# EAGLE design AD590 (EAGLE 9.6.2)
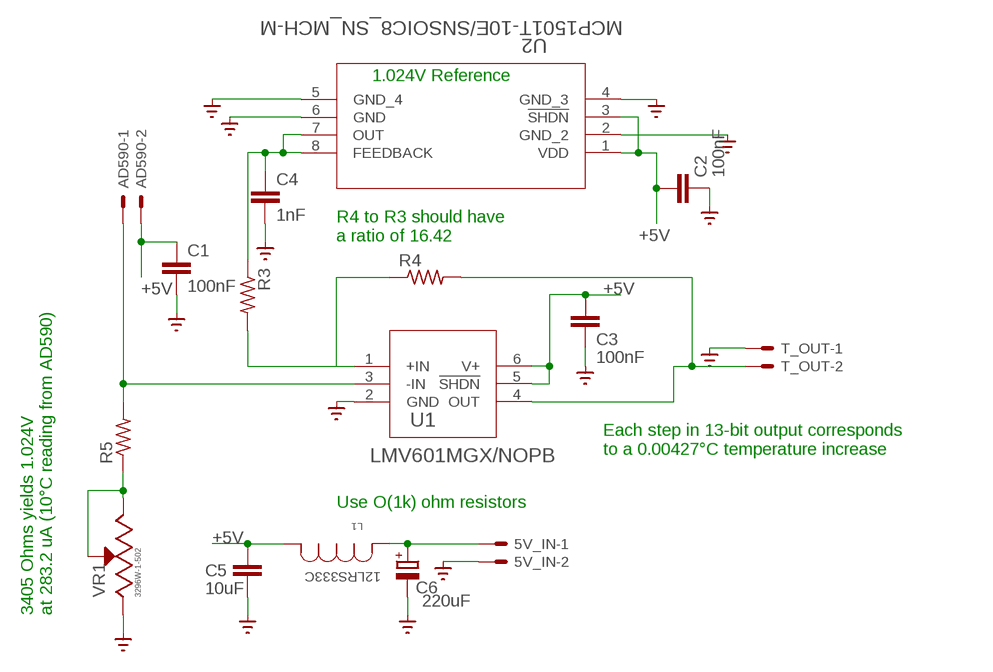
[diagram p0: schematic, sheet 1]

## Parts
5V_IN  JST-XH-02-PIN-LONG-PAD  [JST-XH-02-PACKAGE-LONG-PAD]
AD590  JST-XH-02-PIN-LONG-PAD  [JST-XH-02-PACKAGE-LONG-PAD]
C1  100nF  C-EUC0603  [C0603]
C2  100nF  C-EUC0603  [C0603]
C3  100nF  C-EUC0603  [C0603]
C4  1nF  C-EUC0603  [C0603]
C5  10uF  C-EUC0603  [C0603]
C6  220uF  CPOL-EUE3.5-8  [E3,5-8]
L1  12LRS333C  [IND_MURATA_1200LRS_MUR]
R3  R-US_R1206  [R1206]
R4  R-US_R1206  [R1206]
R5  R-US_R1206  [R1206]
T_OUT  JST-XH-02-PIN-LONG-PAD  [JST-XH-02-PACKAGE-LONG-PAD]
U1  LMV601MGX/NOPB  [DCK6_TEX]
U2  MCP1501T-10E/SNSOIC8_SN_MCH-M  [SOIC8_SN_MCH-M]
VR1  3296W-1-502  [TRIM_3296W-1-502]

## Nets
+5V: AD590.2 C1.1 C2.1 C3.1 C5.1 L1.1 U1.5(!SHDN) U1.6(V+) U2.1(VDD) U2.3(!SHDN)
GND: 5V_IN.2 C1.2 C2.2 C3.2 C4.2 C5.2 C6.- T_OUT.1 U1.2(GND) U2.2(GND_2) U2.4(GND_3) U2.5(GND_4) U2.6(GND) VR1.1(CCW) ; supply symbol labelled SUPPLY0_GND_
N$1: R5.1 VR1.2(WIPER) VR1.3(CW)
N$2: AD590.1 R5.2 U1.3(-IN)
N$4: C4.1 R3.1 U2.7(OUT) U2.8(FEEDBACK)
N$5: 5V_IN.1 C6.+ L1.3
N$6: R4.2 T_OUT.2 U1.4(OUT)
N$9: R3.2 R4.1 U1.1(+IN)

## Notes on the sheet
- 1.024V Reference
- R4 to R3 should have
  a ratio of 16.42
- Each step in 13-bit output corresponds
  to a 0.00427°C temperature increase
- Use O(1k) ohm resistors
- 3405 Ohms yields 1.024V 
  at 283.2 uA (10°C reading from AD590)

## Library data of the parts
5V_IN AD590 T_OUT = Rembrandt Electronics - JST XH Connectors v1-0:JST-XH-02-PIN: JST XH Connector 2 Pin Wire to board connector. Pitch: 2,54 mm, (0.100") Number of pins: 2 Created by Rembrandt Electronics www.rembrandtelectronics.com
C1-C5 = rcl:C-EU: CAPACITOR, European symbol; SPICEPREFIX: C
C6 = rcl:CPOL-EU: POLARIZED CAPACITOR, European symbol; SPICEPREFIX: C
L1 = 12LRS333C:12LRS333C: MURATA 33uH 2.1A INDUCTOR; BUILT_BY: EMA_UL_Team; MANUFACTURER_PART_NUMBER: 12LRS333C; SOURCELIBRARY: Murata_2010-01-01IND_1200LRS; VENDOR: Murata
R3-R5 = rcl:R-US_: RESISTOR, American symbol; SPICEPREFIX: R
U1 = LMV601MGX:NOPB:LMV601MGX/NOPB; COPYRIGHT: Copyright (C) 2022 Ultra Librarian. All rights reserved.; DIGI-KEY_PART_NUMBER_1: 296-46438-1-ND; DIGI-KEY_PART_NUMBER_2: 296-46438-2-ND; DIGI-KEY_PART_NUMBER_3: 296-46438-6-ND; DIGI-KEY_PART_NUMBER_4: LMV601MGX/NOPB-ND; MANUFACTURER_PART_NUMBER: LMV601MGX/NOPB; MFR_NAME: Texas Instruments
U2 = MCP1501T-10E:Sn:MCP1501T-10E/SN; COPYRIGHT: Copyright (C) 2022 Ultra Librarian. All rights reserved.; MANUFACTURER_PART_NUMBER: MCP1501T-10E/SN; MFR_NAME: Microchip
VR1 = 3296W-1-502:3296W-1-502: Res Cermet Trimmer 500K Ohm 10% 0.5W 25(Elec)Turn 2.19mm (9.53 X 4.83 X 11.55mm) Pin Thru-Hole Tube; DESCRIPTION: 5 kOhms 0.5W, 1/2W PC Pins Through Hole Trimmer Potentiometer Cermet 25 Turn Top Adjustment; DIGI-KEY_PART_NUMBER: 3296W-1-502RLFTR-ND; MF: Bourns; MP: 3296W-1-502; PACKAGE: SOT-23-5 Bourns

## Board
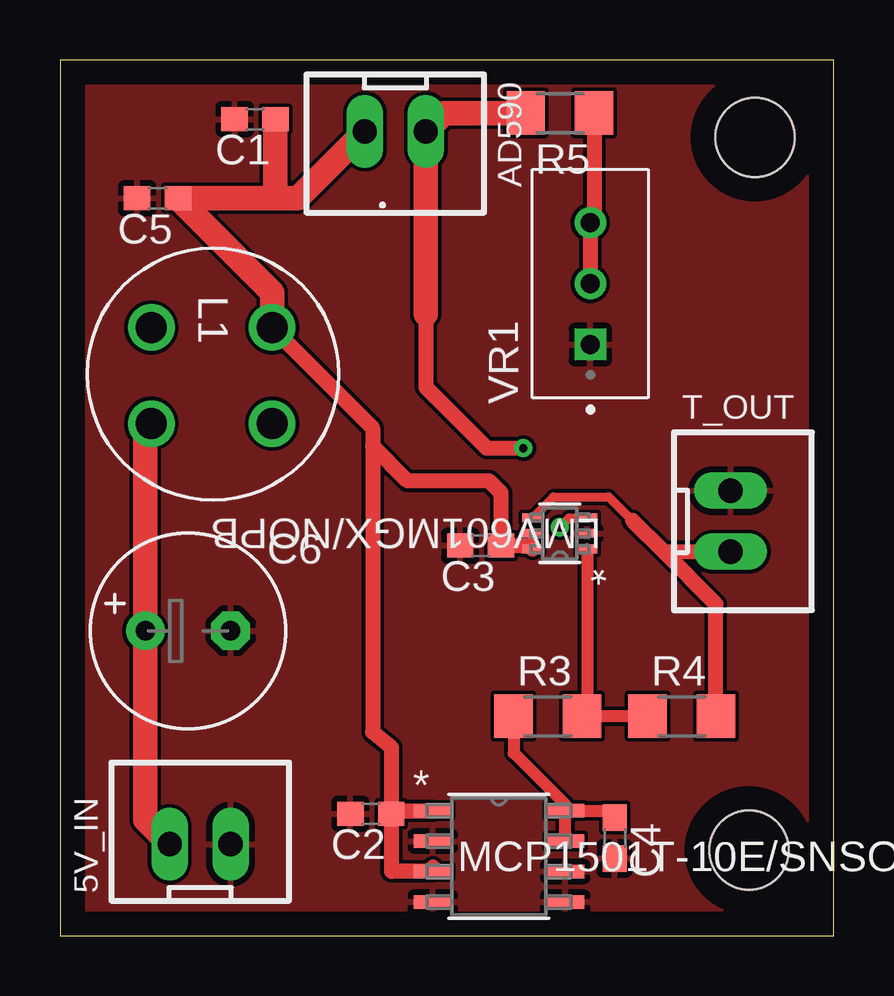
[diagram p1: board, top side]
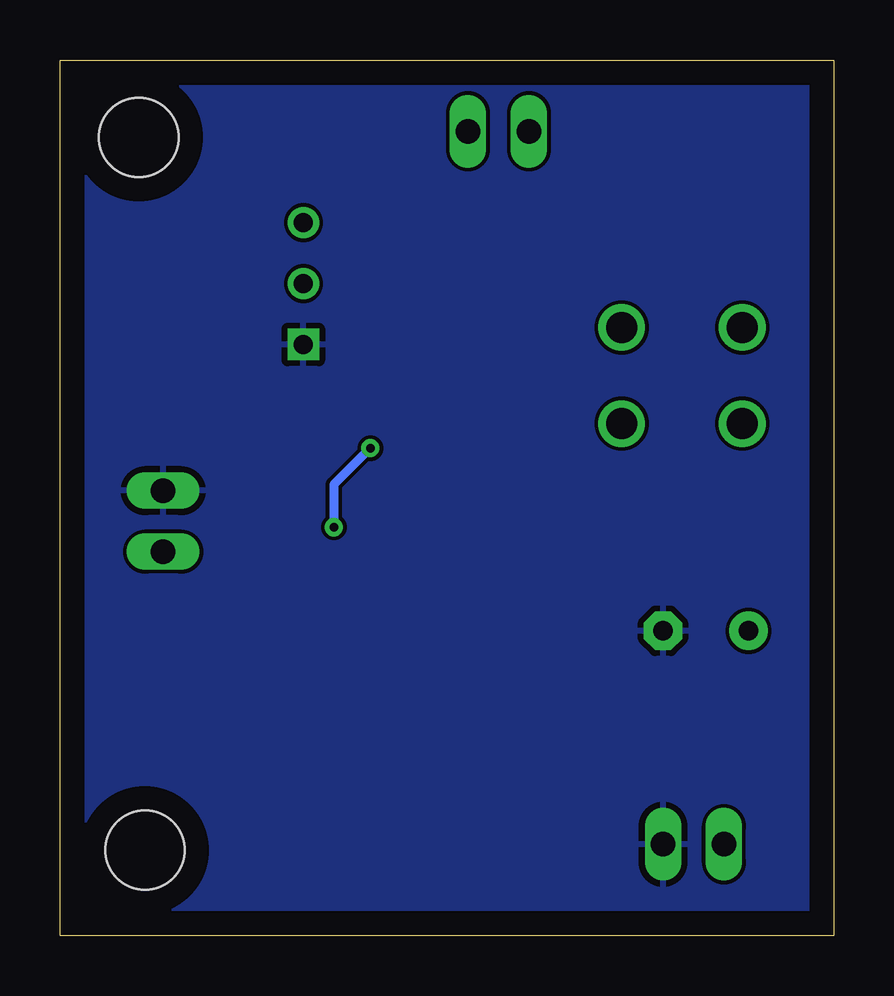
[diagram p2: board, bottom side, seen from below]

Size 32.24 x 36.5 mm. Coordinates in mm from the lower left corner, seen from the top.
Outline: 0,0 32.24,0 32.24,36.5 0,36.5 0,0
Copper layers (1*16): Top 0.035mm / dielectric 1.5mm / Bottom 0.035mm
Design rules "default": minimum track width 6mil, minimum drill 0.35mm, track to track 6mil, track to pad 6mil, pad to pad 6mil, via to via 6mil, smd to smd 6mil, copper to edge 40mil, drill to drill 6mil, minimum pad ring 10mil, minimum via ring 8mil, stop-mask expansion 4mil, vias tented up to drill 0mil, thermal gap 10mil
Holes 3.3 mm at 28.96,33.27 28.7,3.56

### Footprints (pad centres in the part's own frame; a part is rotated, then mirrored left to right if it is on the bottom)
JST-XH-02-PACKAGE-LONG-PAD = drill 1.016 long: 1 -1.27,0; 2 1.27,0
C0603 = smd 1.1 x 1: 1 -0.85,0; 2 0.85,0
E3,5-8 = drill 0.813 pad 1.6: + -1.778,0 | drill 0.813 pad 1.6 octagon: - 1.778,0
IND_MURATA_1200LRS_MUR = drill 1.295 pad 1.803: 1 -4.775,5.283; 2 -4.775,0.254; 3 -0.762,0.254; 4 -0.762,5.283
R1206 = smd 1.6 x 1.803: 1 -1.422,0; 2 1.422,0
DCK6_TEX = smd 0.851 x 0.356: 1 -1.137,0.65; 2 -1.137,0; 3 -1.137,-0.65; 4 1.137,-0.65; 5 1.137,0; 6 1.137,0.65
SOIC8_SN_MCH-M = smd 1.6 x 0.559: 1 -2.756,1.905; 2 -2.756,0.635; 3 -2.756,-0.635; 4 -2.756,-1.905; 5 2.756,-1.905; 6 2.756,-0.635; 7 2.756,0.635; 8 2.756,1.905
TRIM_3296W-1-502 = drill 0.8 square: 1 -2.54,0 | drill 0.8: 2 0,0; 3 2.54,0

### Placement (x,y rotation side)
5V_IN  5.84,3.81 0 top
AD590  13.97,33.53 180 top
C1  8.13,34.04 180 top
C2  12.95,5.08 180 top
C3  17.53,16.26 180 top
C4  23.11,4.06 270 top
C5  4.06,30.73 180 top
C6  5.33,12.7 0 top
L1  3.56,20.57 270 top
R3  20.32,9.14 0 top
R4  25.91,9.14 0 top
R5  20.83,34.29 180 top
T_OUT  27.94,17.27 270 top
U1  20.83,16.76 180 top
U2  18.29,3.3 0 top
VR1  22.1,27.18 90 top

### Tracks (layer width: path | path; a pad name or v marks a point on that pad's centre or on a via)
+5V
  Top 0.381: U1.6 U1.5
  Top 0.635: L1.1 13.03,21.16 13.03,20.4 | 13.03,20.4 14.48,18.95 17.88,18.95 18.38,18.45 C3.1 19.55,16.26 U1.6 | 13.03,20.4 13.03,8.48 13.8,7.83 C2.1 | 15.53,2.84 U2.3 13.8,2.67 C2.1 | C2.1 13.93,5.21 U2.1
  Top 1.016: L1.1 8.84,26.81 C5.1 8.89,30.73 | 8.89,30.73 9.91,30.73 AD590.2 | C1.1 8.98,30.82 8.89,30.73
GND
  pour Top: 0,36.58 32.26,36.58 32.26,0 0,0
  pour Bottom: 0,36.58 32.26,36.58 32.26,0 0,0
N$1
  Top 0.635: R5.1 22.25,29.87 VR1.3 VR1.2
N$2  (via drill 0.35)
  Top 0.381: v20.83,17.02 21.22,17.41 U1.3
  Top 0.635: 15.24,25.91 15.24,22.86 17.78,20.32 v19.3,20.32
  Top 1.016: R5.2 16,34.29 AD590.1 15.24,25.91
  Bottom 0.381: v19.3,20.32 20.83,18.8 v20.83,17.02
N$4
  Top 0.508: U2.7 U2.8 | U2.8 22.82,5.21 C4.1 | R3.1 18.9,7.61 21.04,5.46 U2.8
N$5
  Top 1.016: 5V_IN.1 3.56,4.83 C6.+ 3.56,21.08 L1.3
N$6
  Top 0.381: U1.4 20.57,18.29 22.86,18.29 23.84,17.3
  Top 0.635: 27.33,9.65 R4.2 27.33,13.82 25.15,16 | 23.84,17.3 25.15,16 | 25.15,16 T_OUT.2
N$9
  Top 0.508: R4.1 R3.2 21.96,9.37 U1.1